# Altium schematic sheet arduino due connection.SchDoc
size A4
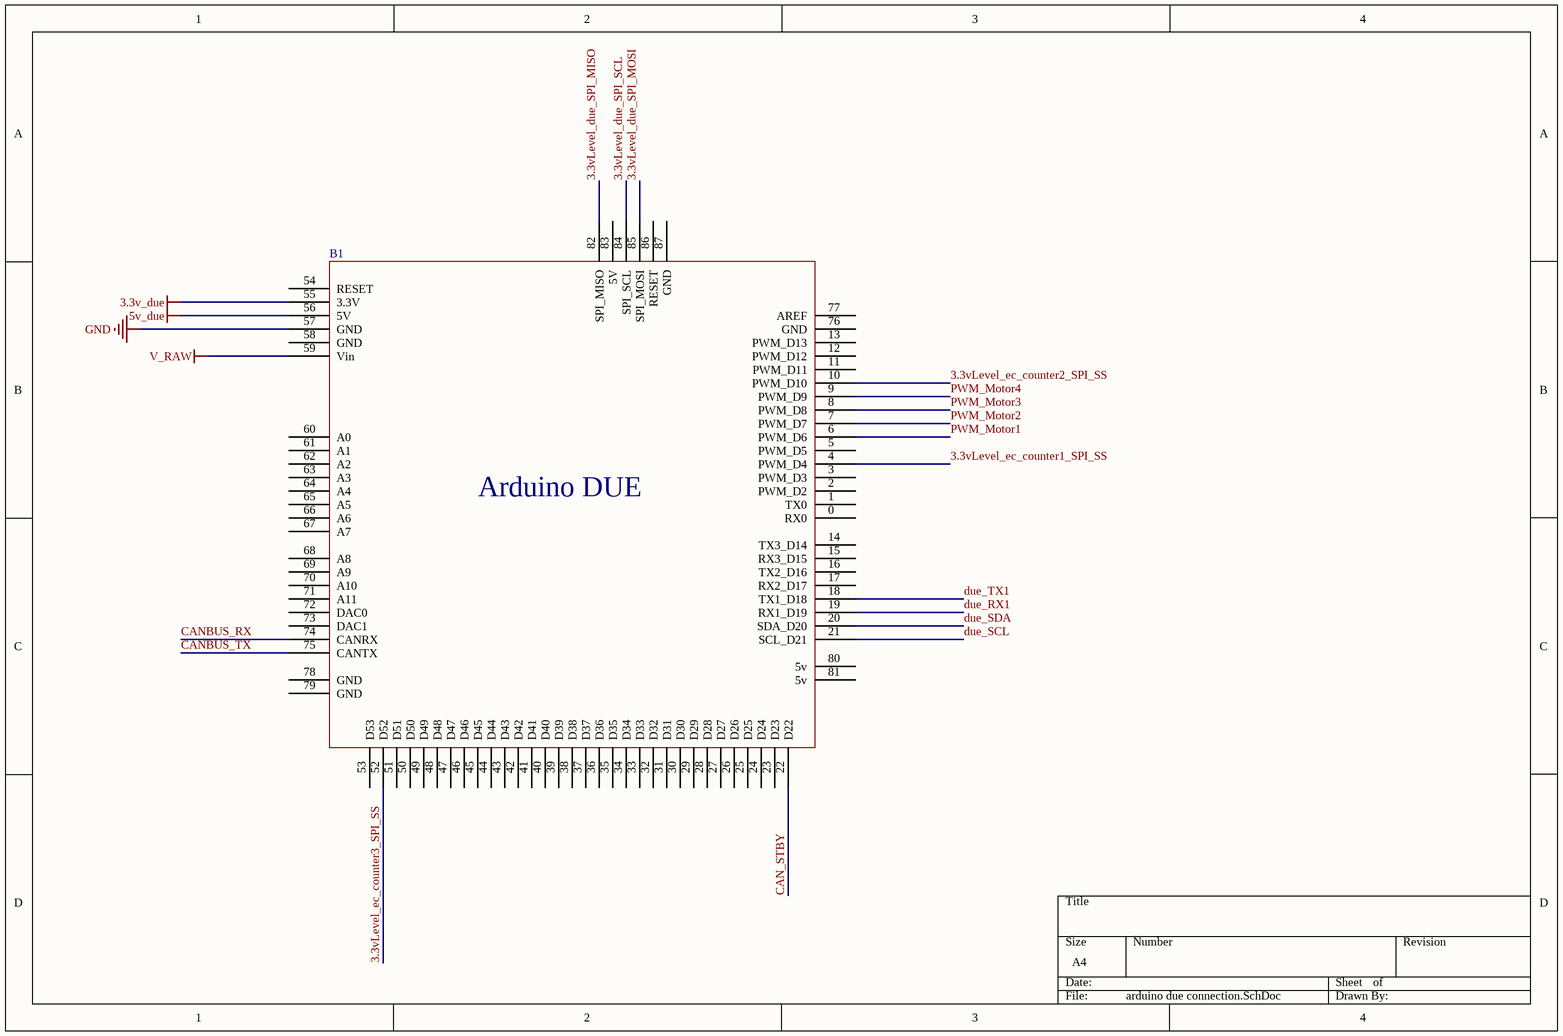
[diagram p0: arduino due connection.SchDoc]

## Parts
B1  arduino due  [PCBComponent_1]  (value not drawn)

## Nets
3.3v_due: B1.55(3.3V)
5v_due: B1.56(5V)
GND: B1.57(GND)
V_RAW: B1.59(Vin)
3.3vLevel_due_SPI_MISO: B1.82(SPI_MISO)
3.3vLevel_due_SPI_MOSI: B1.85(SPI_MOSI)
3.3vLevel_due_SPI_SCL: B1.84(SPI_SCL)
3.3vLevel_ec_counter1_SPI_SS: B1.4(PWM_D4)
3.3vLevel_ec_counter2_SPI_SS: B1.10(PWM_D10)
3.3vLevel_ec_counter3_SPI_SS: B1.52(D52)
CAN_STBY: B1.22(D22)
CANBUS_RX: B1.74(CANRX)
CANBUS_TX: B1.75(CANTX)
due_RX1: B1.19(RX1_D19)
due_SCL: B1.21(SCL_D21)
due_SDA: B1.20(SDA_D20)
due_TX1: B1.18(TX1_D18)
PWM_Motor1: B1.6(PWM_D6)
PWM_Motor2: B1.7(PWM_D7)
PWM_Motor3: B1.8(PWM_D8)
PWM_Motor4: B1.9(PWM_D9)

Not connected (* = marked no-connect by the designer): B1 0(RX0) 1(TX0) 2(PWM_D2) 3(PWM_D3) 5(PWM_D5) 11(PWM_D11) 12(PWM_D12) 13(PWM_D13) 14(TX3_D14) 15(RX3_D15) 16(TX2_D16) 17(RX2_D17) 23(D23) 24(D24) 25(D25) 26(D26) 27(D27) 28(D28) 29(D29) 30(D30) 31(D31) 32(D32) 33(D33) 34(D34) 35(D35) 36(D36) 37(D37) 38(D38) 39(D39) 40(D40) 41(D41) 42(D42) 43(D43) 44(D44) 45(D45) 46(D46) 47(D47) 48(D48) 49(D49) 50(D50) 51(D51) 53(D53) 54(RESET) 58(GND) 60(A0) 61(A1) 62(A2) 63(A3) 64(A4) 65(A5) 66(A6) 67(A7) 68(A8) 69(A9) 70(A10) 71(A11) 72(DAC0) 73(DAC1) 76(GND) 77(AREF) 78(GND) 79(GND) 80(5v) 81(5v) 83(5V) 86(RESET) 87(GND)

## Notes on the sheet
- (in symbol arduino due) Arduino DUE